# EAGLE design opamp_module (EAGLE 6.2)
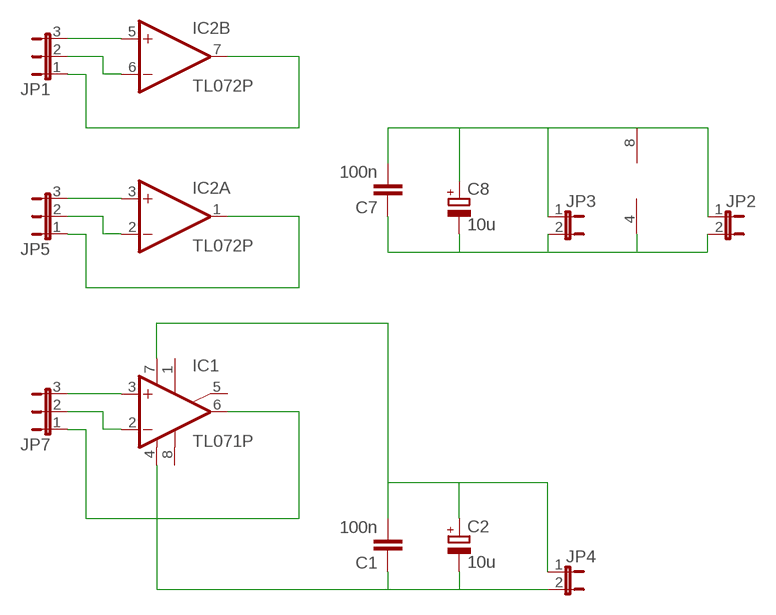
[diagram p0: schematic, sheet 1]

## Parts
C1  100n  C-EU025-024X044  [C025-024X044]
C2  10u  CPOL-EUE2.5-5  [E2,5-5]
C7  100n  C-EU025-024X044  [C025-024X044]
C8  10u  CPOL-EUE2.5-5  [E2,5-5]
IC1  TL071P  [DIL08]
IC2  TL072P  [DIL08]
JP1  JP2E  [JP2]
JP2  JP1E  [JP1]
JP3  JP1E  [JP1]
JP4  JP1E  [JP1]
JP5  JP2E  [JP2]
JP7  JP2E  [JP2]

## Nets
N$1: IC2.2(A:-IN) JP5.2
N$2: C7.1 C8.- IC2.4(P:V-) JP2.2 JP3.2
N$3: IC2.3(A:+IN) JP5.3
N$4: IC2.1(A:OUT) JP5.1
N$5: IC2.5(B:+IN) JP1.3
N$6: IC2.6(B:-IN) JP1.2
N$7: IC2.7(B:OUT) JP1.1
N$8: C7.2 C8.+ IC2.8(P:V+) JP2.1 JP3.1
N$17: C1.1 C2.- IC1.4(V-) JP4.2
N$18: IC1.3(+IN) JP7.3
N$19: IC1.2(-IN) JP7.2
N$20: IC1.6(OUT) JP7.1
N$21: C1.2 C2.+ IC1.7(V+) JP4.1
Unconnected: IC1.1(ON1) IC1.5(ON2) IC1.8(OPT)

## Library data of the parts
C1 C7 = rcl:C-EU: CAPACITOR, European symbol
C2 C8 = rcl:CPOL-EU: POLARIZED CAPACITOR, European symbol
IC1 = linear:TL071: OP AMP
IC2 = linear:TL072: OP AMP
JP1 JP5 JP7 = jumper:JP2E: JUMPER
JP2-JP4 = jumper:JP1E: JUMPER

## Board
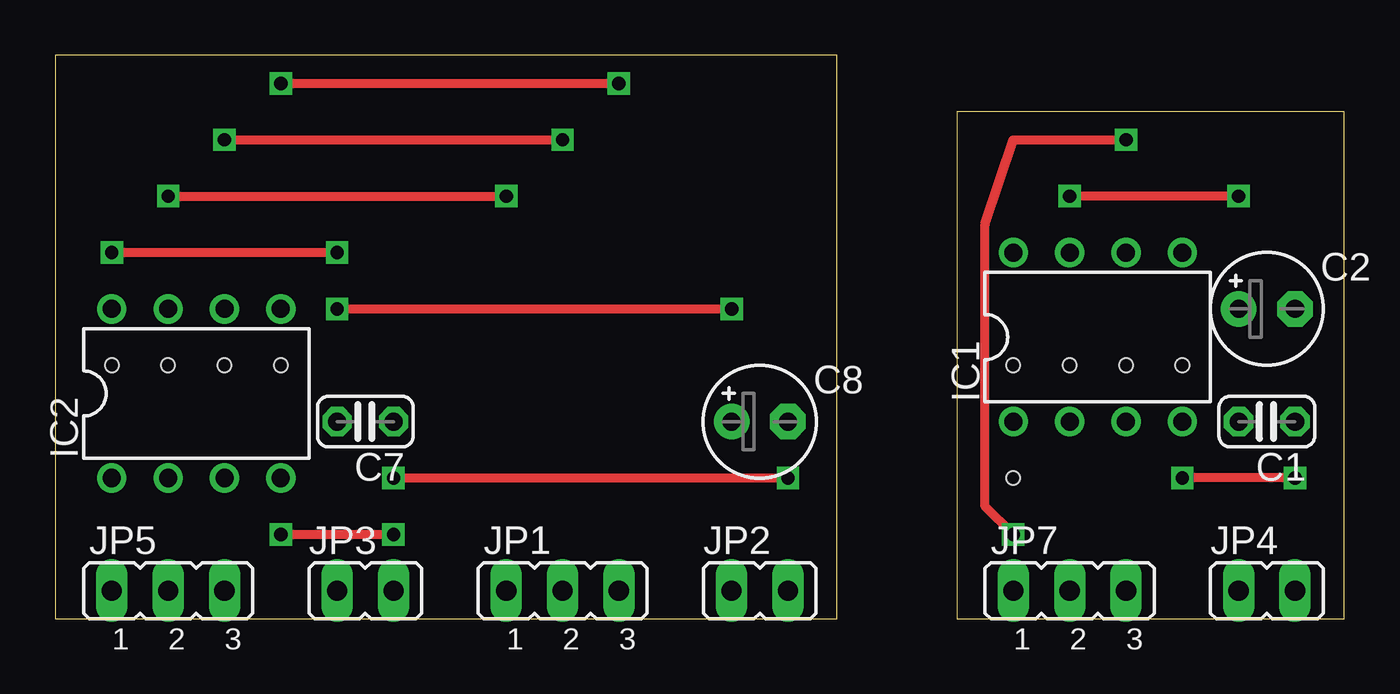
[diagram p1: board, top side]
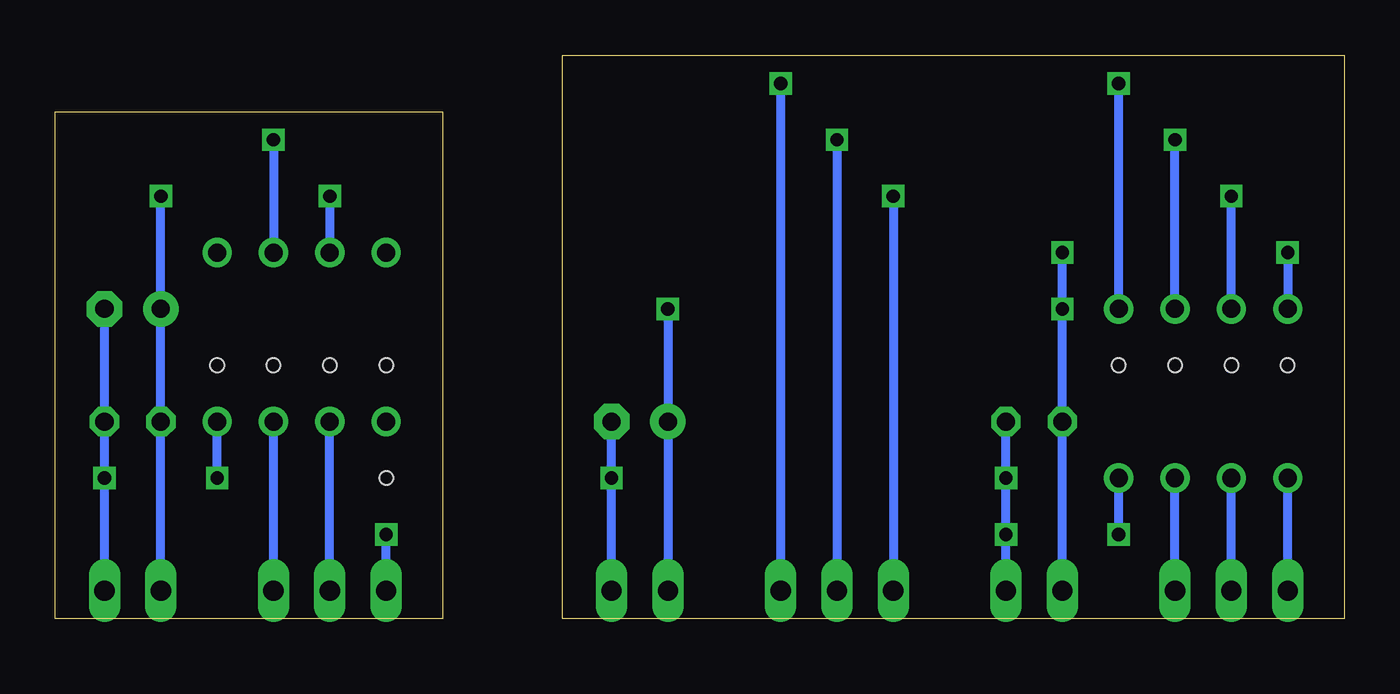
[diagram p2: board, bottom side, seen from below]

Size 58.09 x 25.39 mm. Coordinates in mm from the lower left corner, seen from the top.
Outline: 0,0 35.23,0 35.23,25.39 0,25.39 0,0
Outline: 58.09,22.85 40.64,22.85 40.64,0 58.09,0 58.09,22.85
Copper layers (1*16): Top 0.035mm / dielectric 1.5mm / Bottom 0.035mm
Design rules: minimum track width 10mil, minimum drill 24mil, track to track 8mil, track to pad 8mil, pad to pad 8mil, via to via 8mil, smd to smd 8mil, copper to edge 40mil, drill to drill 8mil, minimum pad ring 10mil, minimum via ring 8mil, stop-mask expansion 4mil, vias tented up to drill 0mil, thermal gap 10mil
Holes 0.6 mm at 2.54,11.43 5.08,11.43 7.62,11.43 10.16,11.43 43.18,11.43 45.72,11.43 48.26,11.43 50.8,11.43 43.18,6.35

### Footprints (pad centres in the part's own frame; a part is rotated, then mirrored left to right if it is on the bottom)
C025-024X044 = drill 0.813 octagon: 1 -1.27,0; 2 1.27,0
E2,5-5 = drill 0.813 pad 1.6: + -1.27,0 | drill 0.813 pad 1.6 octagon: - 1.27,0
DIL08 = drill 0.813 pad 1.27: 1 -3.81,-3.81; 2 -1.27,-3.81; 3 1.27,-3.81; 4 3.81,-3.81; 5 3.81,3.81; 6 1.27,3.81; 7 -1.27,3.81; 8 -3.81,3.81
JP2 = drill 0.914 long: 1 -2.54,0; 2 0,0; 3 2.54,0
JP1 = drill 0.914 long: 1 0,-1.27; 2 0,1.27

### Placement (x,y rotation side)
C1  54.61,8.89 180 top
C2  54.61,13.97 0 top
C7  13.97,8.89 180 top
C8  31.75,8.89 0 top
IC1  46.99,12.7 0 top
IC2  6.35,10.16 0 top
JP1  22.86,1.27 0 top
JP2  31.75,1.27 270 top
JP3  13.97,1.27 270 top
JP4  54.61,1.27 270 top
JP5  5.08,1.27 0 top
JP7  45.72,1.27 0 top

### Tracks (layer width: path | path; a pad name or v marks a point on that pad's centre or on a via)
N$1
  Bottom 0.406: JP5.2 IC2.2
N$2  (via drill 0.6)
  Top 0.406: v10.16,3.81 v15.24,3.81 | v15.24,6.35 v33.02,6.35
  Bottom 0.406: C7.1 v15.24,6.35 v15.24,3.81 JP3.2 | JP2.2 v33.02,6.35 C8.- | v10.16,3.81 IC2.4
N$3
  Bottom 0.406: JP5.3 IC2.3
N$4
  Bottom 0.406: JP5.1 IC2.1
N$5  (via drill 0.6)
  Top 0.406: v10.16,24.13 v25.4,24.13
  Bottom 0.406: IC2.5 v10.16,24.13 | v25.4,24.13 JP1.3
N$6  (via drill 0.6)
  Top 0.406: v7.62,21.59 v22.86,21.59
  Bottom 0.406: IC2.6 v7.62,21.59 | v22.86,21.59 JP1.2
N$7  (via drill 0.6)
  Top 0.406: v5.08,19.05 v20.32,19.05
  Bottom 0.406: IC2.7 v5.08,19.05 | v20.32,19.05 JP1.1
N$8  (via drill 0.6)
  Top 0.406: v12.7,16.51 v2.54,16.51 | v12.7,13.97 v30.48,13.97
  Bottom 0.406: v12.7,16.51 v12.7,13.97 C7.2 JP3.1 | JP2.1 C8.+ v30.48,13.97 | v2.54,16.51 IC2.8
N$9  (via drill 0.6)
  other vias: 20.32,19.05
N$10  (via drill 0.6)
  other vias: 22.86,21.59
N$11  (via drill 0.6)
  other vias: 25.4,24.13
N$13  (via drill 0.6)
  other vias: 2.54,16.51
N$14  (via drill 0.6)
  other vias: 5.08,19.05
N$15  (via drill 0.6)
  other vias: 7.62,21.59
N$16  (via drill 0.6)
  other vias: 10.16,24.13
N$17  (via drill 0.6)
  Top 0.406: v55.88,6.35 v50.8,6.35
  Bottom 0.406: v50.8,6.35 IC1.4 | C2.- C1.1 v55.88,6.35 JP4.2
N$18
  Bottom 0.406: JP7.3 IC1.3
N$19
  Bottom 0.406: JP7.2 IC1.2
N$20  (via drill 0.6)
  Top 0.406: v48.26,21.59 43.18,21.59 41.91,17.78 41.91,5.08 v43.18,3.81
  Bottom 0.406: JP7.1 v43.18,3.81 | v48.26,21.59 IC1.6
N$21  (via drill 0.6)
  Top 0.406: v53.34,19.05 v45.72,19.05
  Bottom 0.406: JP4.1 C1.2 C2.+ v53.34,19.05 | v45.72,19.05 IC1.7

### Text on the board
doc_red: + | + | + | + | VCC | + | VCC | + | VCC
doc_blue: - | - | - | - | GND | - | GND | - | GND
doc_black: out | out | out